# Altium schematic sheet Microcontroller Schematic.SchDoc
size A3; SheetNumber: 1; SheetTotal: 3
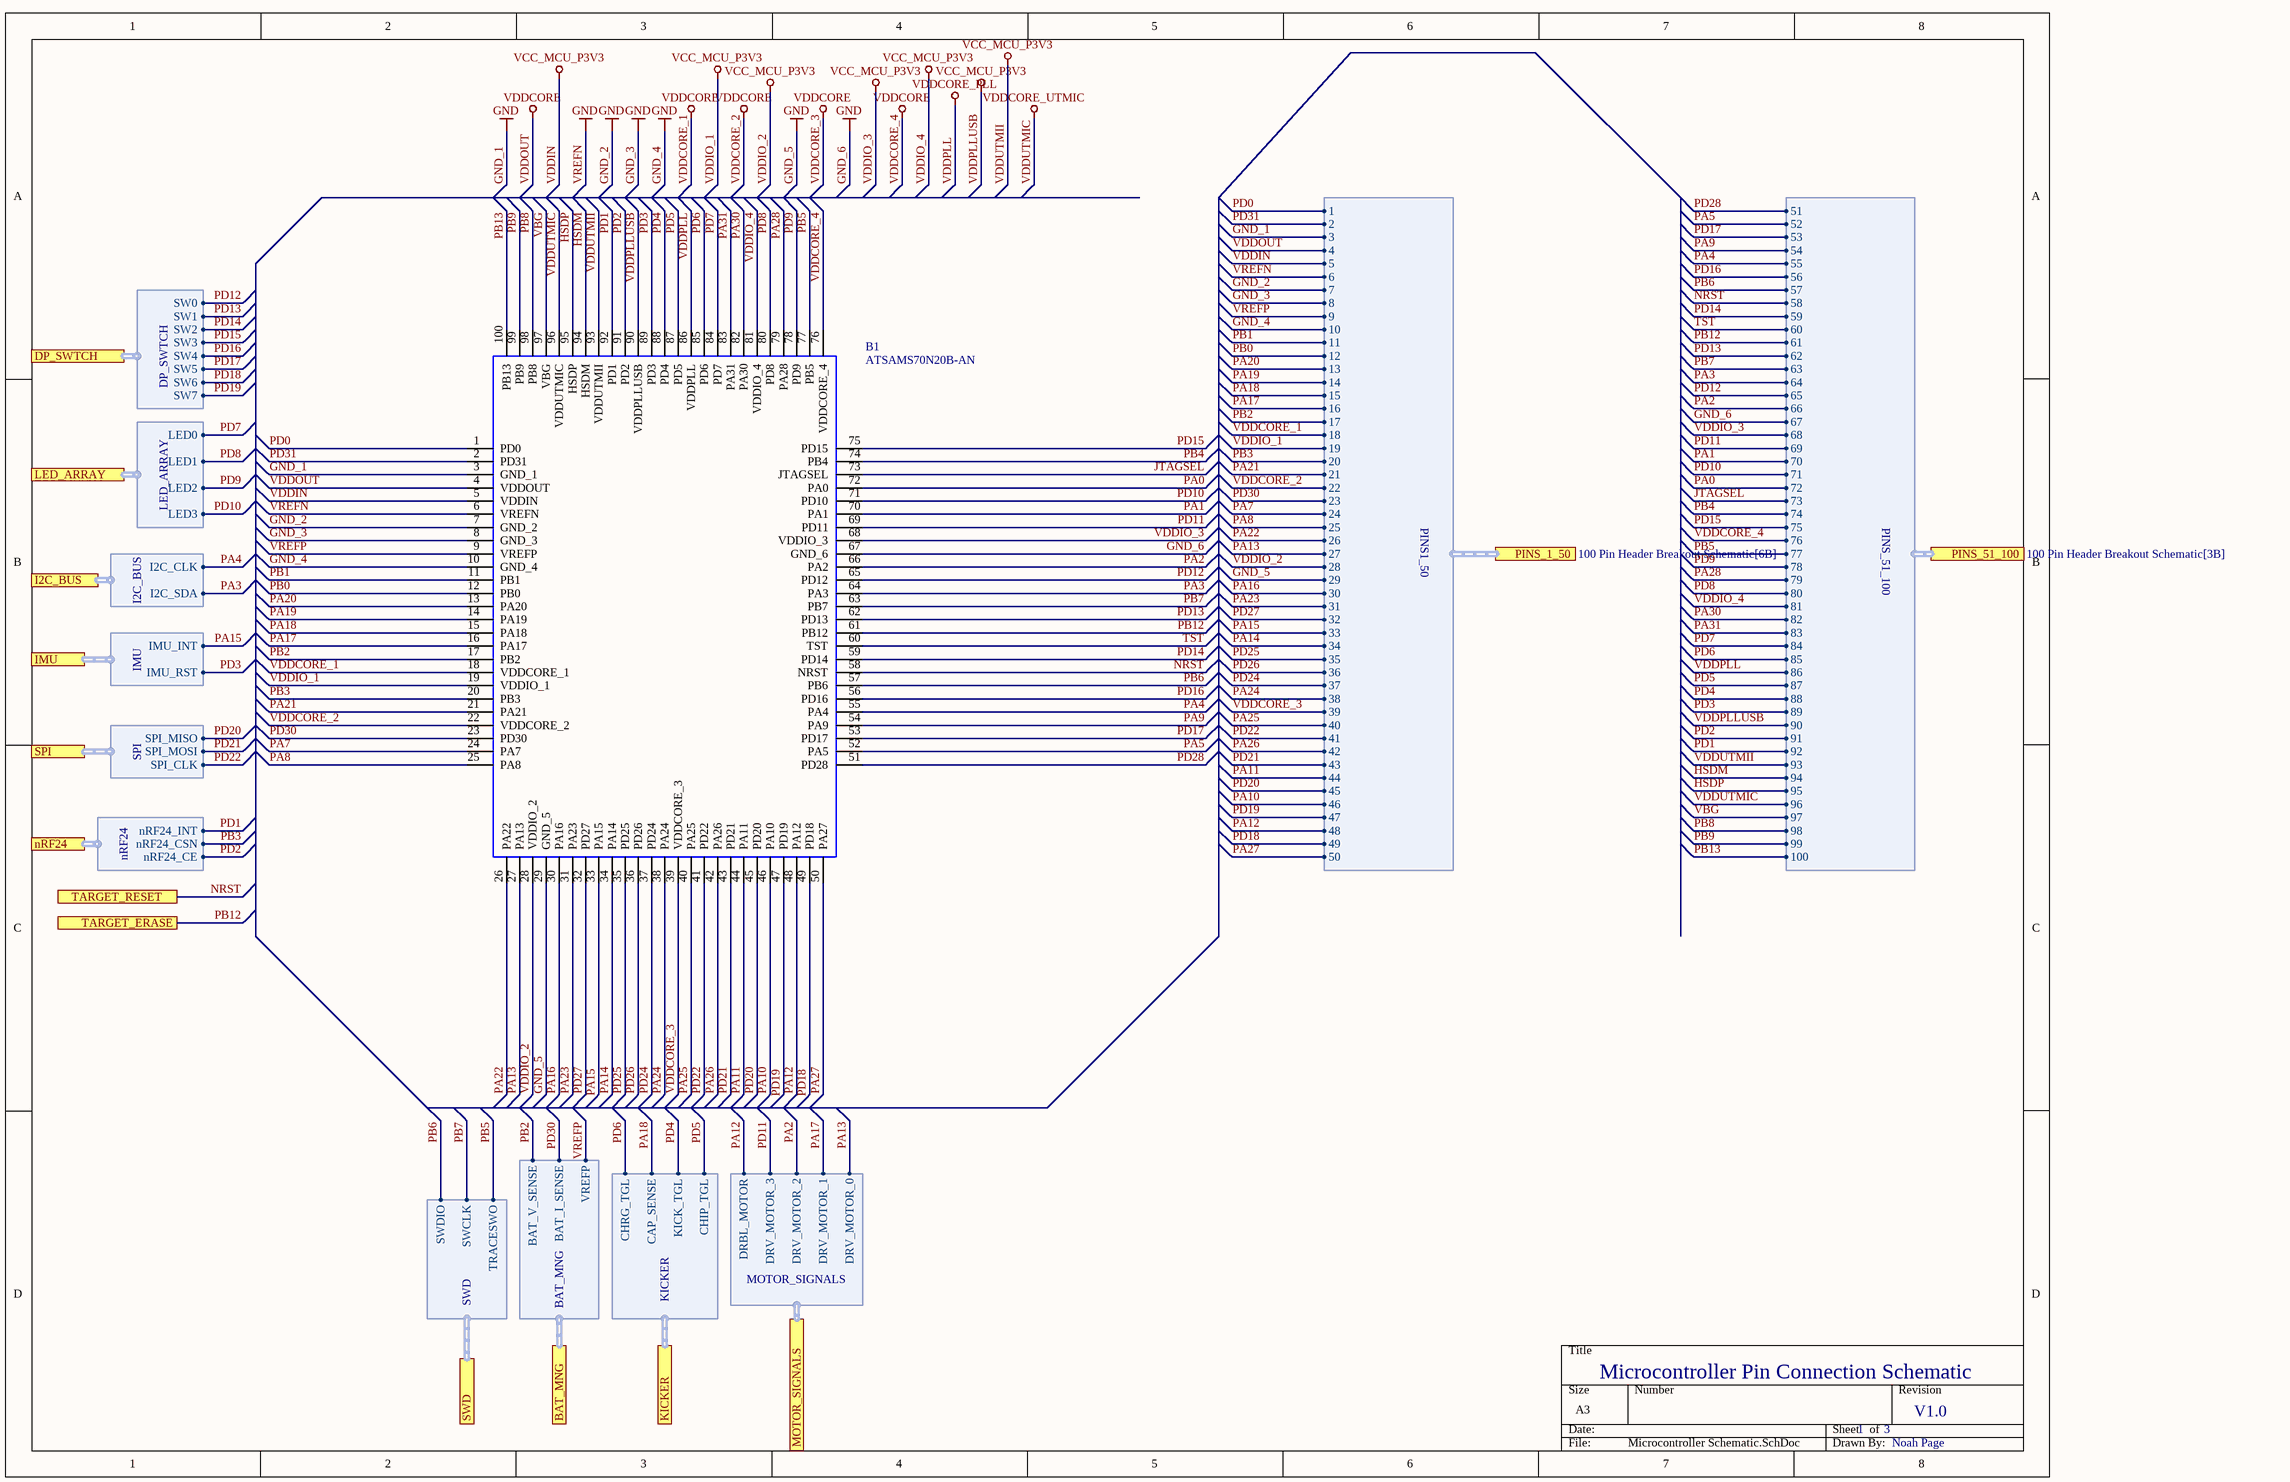
[diagram p0: Microcontroller Schematic.SchDoc]

## Parts
B1  ATSAMS70N20B-AN  [QFP50P1600X1600X160-100N]

## Ports
BAT_MNG (harness BAT_MNG, see Circuit Schematics[6D]), DP_SWTCH (harness DP_SWTCH, see Circuit Schematics[1A]), I2C_BUS (harness I2C_BUS, see Circuit Schematics[1D], Circuit Schematics[3B], Circuit Schematics[6D]), IMU (harness IMU, see Circuit Schematics[1D]), KICKER (harness KICKER, see Circuit Schematics[6C]), LED_ARRAY (harness LED_ARRAY, see Circuit Schematics[1C]), MOTOR_SIGNALS (harness MOTOR_SIGNALS, see Circuit Schematics[5A]), nRF24 (harness nRF24, see Circuit Schematics[3D]), PINS_1_50 (harness PINS1_50, see 100 Pin Header Breakout Schematic[6B]), PINS_51_100 (harness PINS_51_100, see 100 Pin Header Breakout Schematic[3B]), SPI (harness SPI, see Circuit Schematics[3C]), SWD (harness SWD, see Circuit Schematics[5B]), TARGET_ERASE (see Circuit Schematics[3A]), TARGET_RESET (see Circuit Schematics[3A], Circuit Schematics[4B])

## Harnesses
DP_SWTCH: SW0, SW1, SW2, SW3, SW4, SW5, SW6, SW7
LED_ARRAY: LED0, LED1, LED2, LED3
I2C_BUS: I2C_CLK, I2C_SDA
IMU: IMU_INT, IMU_RST
SPI: SPI_MISO, SPI_MOSI, SPI_CLK
nRF24: nRF24_CSN, nRF24_CE, nRF24_INT
SWD: SWDIO, SWCLK, TRACESWO
BAT_MNG: BAT_V_SENSE, BAT_I_SENSE, VREFP
KICKER: CAP_SENSE, CHRG_TGL, KICK_TGL, CHIP_TGL
MOTOR_SIGNALS: DRV_MOTOR_0, DRV_MOTOR_1, DRV_MOTOR_2, DRV_MOTOR_3, DRBL_MOTOR
PINS1_50: 1, 2, 3, 4, 5, 6, 7, 8, 9, 10, 11, 12, 13, 14, 15, 16, 17, 18, 19, 20, 21, 22, 23, 24, 25, 26, 27, 28, 29, 30, 31, 32, 33, 34, 35, 36, 37, 38, 39, 40, 41, 42, 43, 44, 45, 46, 47, 48, 49, 50
PINS_51_100: 51, 52, 53, 54, 55, 56, 57, 58, 59, 60, 61, 62, 63, 64, 65, 66, 67, 68, 69, 70, 71, 72, 73, 74, 75, 76, 77, 78, 79, 80, 81, 82, 83, 84, 85, 86, 87, 88, 89, 90, 91, 92, 93, 94, 95, 96, 97, 98, 99, 100

## Nets
GND_1: B1.3(GND_1) B1.6(VREFN) B1.7(GND_2) B1.8(GND_3) B1.10(GND_4) B1.29(GND_5) B1.67(GND_6) ; port PINS_1_50.3, port PINS_1_50.6, port PINS_1_50.7, port PINS_1_50.8, port PINS_1_50.10, port PINS_1_50.29, port PINS_51_100.67  [also labelled GND, GND_2, GND_3, GND_4, GND_5, GND_6, VREFN]
VDDCORE_1: B1.4(VDDOUT) B1.18(VDDCORE_1) B1.22(VDDCORE_2) B1.39(VDDCORE_3) B1.76(VDDCORE_4) ; port PINS_1_50.4, port PINS_1_50.18, port PINS_1_50.22, port PINS_1_50.39, port PINS_51_100.76  [also labelled VDDCORE, VDDCORE_2, VDDCORE_3, VDDCORE_4, VDDOUT]
VDDIN: B1.5(VDDIN) B1.19(VDDIO_1) B1.28(VDDIO_2) B1.68(VDDIO_3) B1.81(VDDIO_4) B1.90(VDDPLLUSB) B1.93(VDDUTMII) ; port PINS_1_50.5, port PINS_1_50.19, port PINS_1_50.28, port PINS_51_100.68, port PINS_51_100.81, port PINS_51_100.90, port PINS_51_100.93  [also labelled VCC_MCU_P3V3, VDDIO_1, VDDIO_2, VDDIO_3, VDDIO_4, VDDPLLUSB, VDDUTMII]
VDDPLL: B1.86(VDDPLL) ; port PINS_51_100.86  [also labelled VDDCORE_PLL]
VDDUTMIC: B1.96(VDDUTMIC) ; port PINS_51_100.96  [also labelled VDDCORE_UTMIC]
HSDM: B1.94(HSDM) ; port PINS_51_100.94
HSDP: B1.95(HSDP) ; port PINS_51_100.95
JTAGSEL: B1.73(JTAGSEL) ; port PINS_51_100.73
NRST: B1.58(NRST) ; port TARGET_RESET, port PINS_51_100.58
PA0: B1.72(PA0) ; port PINS_51_100.72
PA1: B1.70(PA1) ; port PINS_51_100.70
PA2: B1.66(PA2) ; port MOTOR_SIGNALS.DRV_MOTOR_2, port PINS_51_100.66
PA3: B1.64(PA3) ; port I2C_BUS.I2C_SDA, port PINS_51_100.64
PA4: B1.55(PA4) ; port I2C_BUS.I2C_CLK, port PINS_51_100.55
PA5: B1.52(PA5) ; port PINS_51_100.52
PA7: B1.24(PA7) ; port PINS_1_50.24
PA8: B1.25(PA8) ; port PINS_1_50.25
PA9: B1.54(PA9) ; port PINS_51_100.54
PA10: B1.46(PA10) ; port PINS_1_50.46
PA11: B1.44(PA11) ; port PINS_1_50.44
PA12: B1.48(PA12) ; port MOTOR_SIGNALS.DRBL_MOTOR, port PINS_1_50.48
PA13: B1.27(PA13) ; port MOTOR_SIGNALS.DRV_MOTOR_0, port PINS_1_50.27
PA14: B1.34(PA14) ; port PINS_1_50.34
PA15: B1.33(PA15) ; port IMU.IMU_INT, port PINS_1_50.33
PA16: B1.30(PA16) ; port PINS_1_50.30
PA17: B1.16(PA17) ; port MOTOR_SIGNALS.DRV_MOTOR_1, port PINS_1_50.16
PA18: B1.15(PA18) ; port KICKER.CAP_SENSE, port PINS_1_50.15
PA19: B1.14(PA19) ; port PINS_1_50.14
PA20: B1.13(PA20) ; port PINS_1_50.13
PA21: B1.21(PA21) ; port PINS_1_50.21
PA22: B1.26(PA22) ; port PINS_1_50.26
PA23: B1.31(PA23) ; port PINS_1_50.31
PA24: B1.38(PA24) ; port PINS_1_50.38
PA25: B1.40(PA25) ; port PINS_1_50.40
PA26: B1.42(PA26) ; port PINS_1_50.42
PA27: B1.50(PA27) ; port PINS_1_50.50
PA28: B1.79(PA28) ; port PINS_51_100.79
PA30: B1.82(PA30) ; port PINS_51_100.82
PA31: B1.83(PA31) ; port PINS_51_100.83
PB0: B1.12(PB0) ; port PINS_1_50.12
PB1: B1.11(PB1) ; port PINS_1_50.11
PB2: B1.17(PB2) ; port BAT_MNG.BAT_V_SENSE, port PINS_1_50.17
PB3: B1.20(PB3) ; port nRF24.nRF24_CSN, port PINS_1_50.20
PB4: B1.74(PB4) ; port PINS_51_100.74
PB5: B1.77(PB5) ; port SWD.TRACESWO, port PINS_51_100.77
PB6: B1.57(PB6) ; port SWD.SWDIO, port PINS_51_100.57
PB7: B1.63(PB7) ; port SWD.SWCLK, port PINS_51_100.63
PB8: B1.98(PB8) ; port PINS_51_100.98
PB9: B1.99(PB9) ; port PINS_51_100.99
PB12: B1.61(PB12) ; port TARGET_ERASE, port PINS_51_100.61
PB13: B1.100(PB13) ; port PINS_51_100.100
PD0: B1.1(PD0) ; port PINS_1_50.1
PD1: B1.92(PD1) ; port nRF24.nRF24_INT, port PINS_51_100.92
PD2: B1.91(PD2) ; port nRF24.nRF24_CE, port PINS_51_100.91
PD3: B1.89(PD3) ; port IMU.IMU_RST, port PINS_51_100.89
PD4: B1.88(PD4) ; port KICKER.KICK_TGL, port PINS_51_100.88
PD5: B1.87(PD5) ; port KICKER.CHIP_TGL, port PINS_51_100.87
PD6: B1.85(PD6) ; port KICKER.CHRG_TGL, port PINS_51_100.85
PD7: B1.84(PD7) ; port LED_ARRAY.LED0, port PINS_51_100.84
PD8: B1.80(PD8) ; port LED_ARRAY.LED1, port PINS_51_100.80
PD9: B1.78(PD9) ; port LED_ARRAY.LED2, port PINS_51_100.78
PD10: B1.71(PD10) ; port LED_ARRAY.LED3, port PINS_51_100.71
PD11: B1.69(PD11) ; port MOTOR_SIGNALS.DRV_MOTOR_3, port PINS_51_100.69
PD12: B1.65(PD12) ; port DP_SWTCH.SW0, port PINS_51_100.65
PD13: B1.62(PD13) ; port DP_SWTCH.SW1, port PINS_51_100.62
PD14: B1.59(PD14) ; port DP_SWTCH.SW2, port PINS_51_100.59
PD15: B1.75(PD15) ; port DP_SWTCH.SW3, port PINS_51_100.75
PD16: B1.56(PD16) ; port DP_SWTCH.SW4, port PINS_51_100.56
PD17: B1.53(PD17) ; port DP_SWTCH.SW5, port PINS_51_100.53
PD18: B1.49(PD18) ; port DP_SWTCH.SW6, port PINS_1_50.49
PD19: B1.47(PD19) ; port DP_SWTCH.SW7, port PINS_1_50.47
PD20: B1.45(PD20) ; port SPI.SPI_MISO, port PINS_1_50.45
PD21: B1.43(PD21) ; port SPI.SPI_MOSI, port PINS_1_50.43
PD22: B1.41(PD22) ; port SPI.SPI_CLK, port PINS_1_50.41
PD24: B1.37(PD24) ; port PINS_1_50.37
PD25: B1.35(PD25) ; port PINS_1_50.35
PD26: B1.36(PD26) ; port PINS_1_50.36
PD27: B1.32(PD27) ; port PINS_1_50.32
PD28: B1.51(PD28) ; port PINS_51_100.51
PD30: B1.23(PD30) ; port BAT_MNG.BAT_I_SENSE, port PINS_1_50.23
PD31: B1.2(PD31) ; port PINS_1_50.2
TST: B1.60(TST) ; port PINS_51_100.60
VBG: B1.97(VBG) ; port PINS_51_100.97
VREFP: B1.9(VREFP) ; port BAT_MNG.VREFP, port PINS_1_50.9

## Notes on the sheet
- Microcontroller Pin Connection Schematic
- 1
- 3
- V1.0
- Noah Page

## Library data of the parts
B1 = ATSAMS70N20B-AN: ARM Microcontrollers - MCU CM7,1024kB Flash,384kB SRAM,LQFP100; Manufacturer_Name: Microchip; Geometry.Height: 1.6mm; Mouser Part Number: 556-ATSAMS70N20B-AN; Mouser Price/Stock: https://www.mouser.co.uk/ProductDetail/Microchip-Technology-Atmel/ATSAMS70N20B-AN?qs=rrS6PyfT74f9aEDiDShVYw%3D%3D; Manufacturer_Part_Number: ATSAMS70N20B-AN; Datasheet Link: https://datasheet.datasheetarchive.com/originals/distributors/DKDS41/DSANUWW0026633.pdf